# Altium project ELOC_Transmitter.PrjPcb
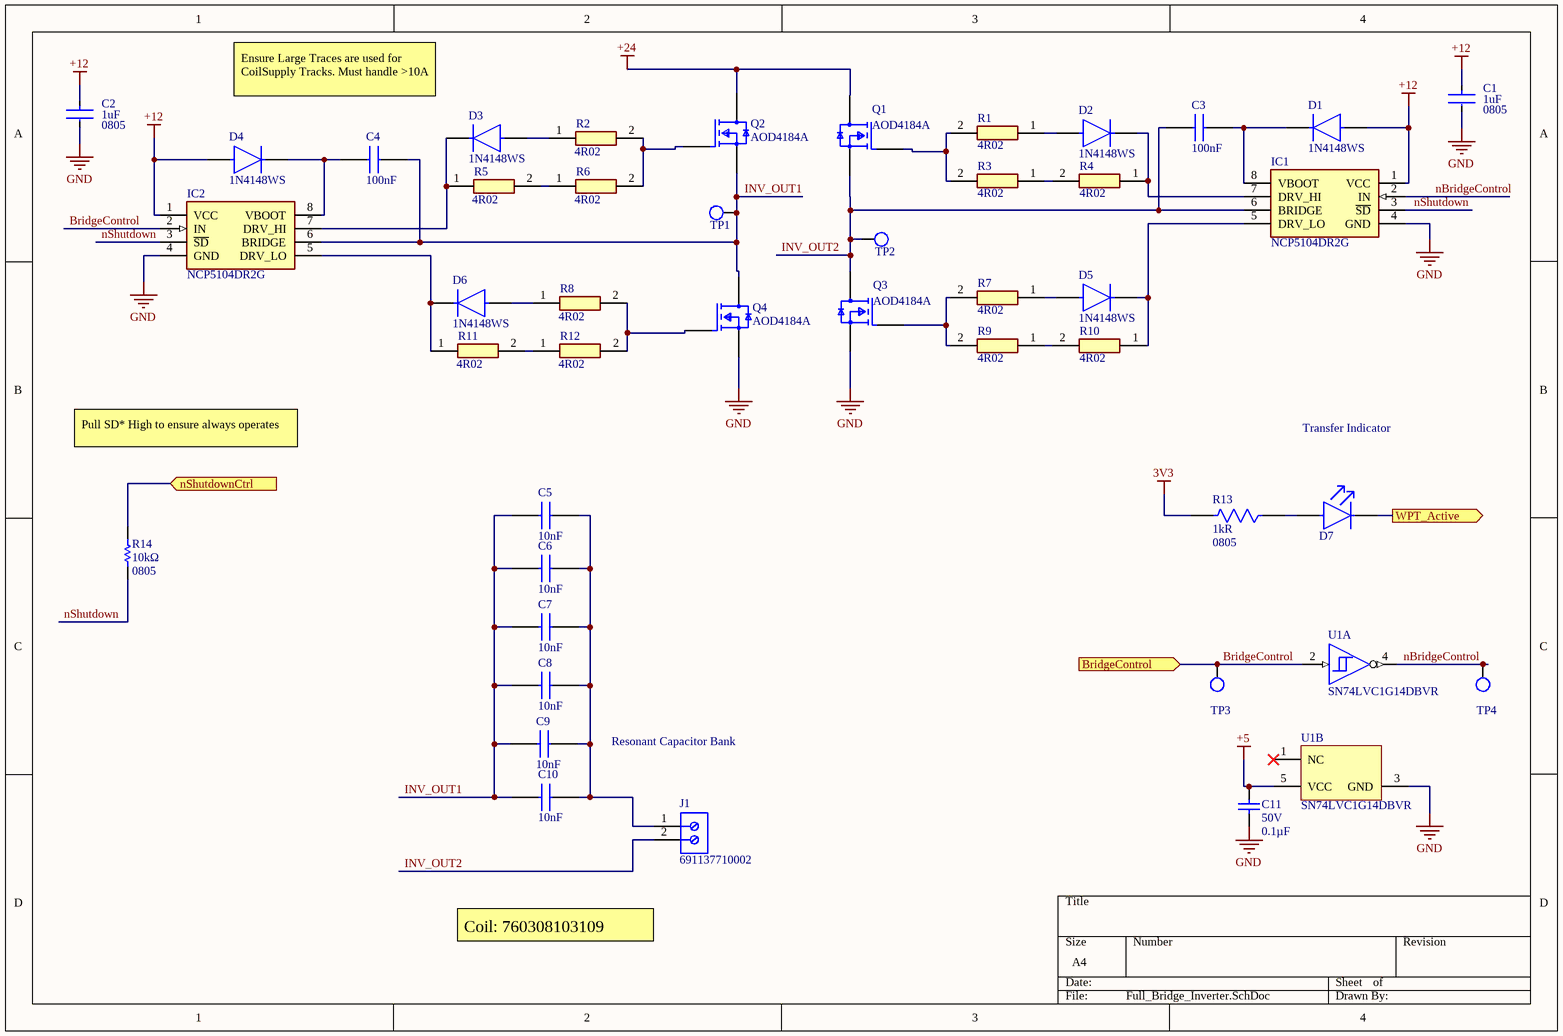
[diagram p0: Full_Bridge_Inverter.SchDoc]
3 sheets, 105 parts. Net scope: flat (ports and power ports of the same name join across sheets).
Board file: ELOC_Transmitter.PcbDoc
Sheets:
  Full_Bridge_Inverter.SchDoc
  Power.SchDoc
  Processor.SchDoc

## Sheet Full_Bridge_Inverter.SchDoc
size A4; SheetNumber: 1; SheetTotal: 3

### Parts
C1  Capacitance: 1uF  Case Code (Imperial): 0805  [FP-885012207078-MFG]  (hidden comment: 885012207078)
C2  Capacitance: 1uF  Case Code (Imperial): 0805  [FP-885012207078-MFG]  (hidden comment: 885012207078)
C3  Capacitance: 100nF  [C0805]  (hidden comment: C0805C104K1RACAUTO7210)
C4  Capacitance: 100nF  [C0805]  (hidden comment: C0805C104K1RACAUTO7210)
C5  Capacitance: 10nF  [CAPC3216X110N]  (hidden comment: C1206C103JAGECAUTO)
C6  Capacitance: 10nF  [CAPC3216X110N]  (hidden comment: C1206C103JAGECAUTO)
C7  Capacitance: 10nF  [CAPC3216X110N]  (hidden comment: C1206C103JAGECAUTO)
C8  Capacitance: 10nF  [CAPC3216X110N]  (hidden comment: C1206C103JAGECAUTO)
C9  Capacitance: 10nF  [CAPC3216X110N]  (hidden comment: C1206C103JAGECAUTO)
C10  Capacitance: 10nF  [CAPC3216X110N]  (hidden comment: C1206C103JAGECAUTO)
C11  Voltage - Rated: 50V  Capacitance: 0.1µF  [CAP0805]  (hidden comment: C0805C104K5RACTU)
D1  1N4148WS  [FP-477AB-IPC_C]
D2  1N4148WS  [FP-477AB-IPC_C]
D3  1N4148WS  [FP-477AB-IPC_C]
D4  1N4148WS  [FP-477AB-IPC_C]
D5  1N4148WS  [FP-477AB-IPC_C]
D6  1N4148WS  [FP-477AB-IPC_C]
D7  150060VS75000  [FP-150060VS75000-MFG]  (value not drawn)
IC1  NCP5104DR2G  [SOIC127P600X175-8N]
IC2  NCP5104DR2G  [SOIC127P600X175-8N]
J1  691137710002  [691137710002]
Q1  AOD4184A  [FP-TO252-MFG]
Q2  AOD4184A  [FP-TO252-MFG]
Q3  AOD4184A  [FP-TO252-MFG]
Q4  AOD4184A  [FP-TO252-MFG]
R1  Resistance: 4R02  [RESC3216X70N]  (hidden comment: RMCF1206FT4R02)
R2  Resistance: 4R02  [RESC3216X70N]  (hidden comment: RMCF1206FT4R02)
R3  Resistance: 4R02  [RESC3216X70N]  (hidden comment: RMCF1206FT4R02)
R4  Resistance: 4R02  [RESC3216X70N]  (hidden comment: RMCF1206FT4R02)
R5  Resistance: 4R02  [RESC3216X70N]  (hidden comment: RMCF1206FT4R02)
R6  Resistance: 4R02  [RESC3216X70N]  (hidden comment: RMCF1206FT4R02)
R7  Resistance: 4R02  [RESC3216X70N]  (hidden comment: RMCF1206FT4R02)
R8  Resistance: 4R02  [RESC3216X70N]  (hidden comment: RMCF1206FT4R02)
R9  Resistance: 4R02  [RESC3216X70N]  (hidden comment: RMCF1206FT4R02)
R10  Resistance: 4R02  [RESC3216X70N]  (hidden comment: RMCF1206FT4R02)
R11  Resistance: 4R02  [RESC3216X70N]  (hidden comment: RMCF1206FT4R02)
R12  Resistance: 4R02  [RESC3216X70N]  (hidden comment: RMCF1206FT4R02)
R13  Resistance: 1kR  Size Code: 0805  [FP-RNCP0805-MFG]  (hidden comment: RNCP0805FTD1K00)
R14  Resistance: 10kΩ  Package / Case: 0805  [RES0805]  (hidden comment: RC0805FR-0710KL)
TP1  Bridge 1  [TESTPOINT_LOOP]  (value not drawn)
TP2  Bridge 2  [TESTPOINT_LOOP]  (value not drawn)
TP3  Oscillator Out  [TESTPOINT_LOOP]  (value not drawn)
TP4  NOT Oscillator Out  [TESTPOINT_LOOP]  (value not drawn)
U1  SN74LVC1G14DBVR  [DBV0005A_L]  (parts A,B of 2)

### Ports
BridgeControl (in), nShutdownCtrl (in), WPT_Active (out)

### Nets
3V3: R13.2
+5: C11.2 U1.5(VCC)
+12: C1.1 C2.1 D1.2(A) D4.2(A) IC1.1(VCC) IC2.1(VCC)
+24: Q1.4(D) Q2.4(D)
GND: C1.2 C2.2 C11.1 IC1.4(GND) IC2.4(GND) Q3.3(S) Q4.3(S) U1.3(GND)
BridgeControl: IC2.2(IN) TP3.1 U1.2(A) ; port BridgeControl
INV_OUT1: C4.2 C5.1 C6.1 C7.1 C8.2 C9.2 C10.2 IC2.6(BRIDGE) Q2.3(S) Q4.4(D) TP1.1
INV_OUT2: C3.1 IC1.6(BRIDGE) J1.2 Q1.3(S) Q3.4(D) TP2.1
nBridgeControl: IC1.2(IN) TP4.1 U1.4(Y)
nShutdown: IC1.3(~{SD}) IC2.3(~{SD}) R14.1
NetC3_2: C3.2 D1.1(C) IC1.8(VBOOT)
NetC4_1: C4.1 D4.1(C) IC2.8(VBOOT)
NetC5_2: C5.2 C6.2 C7.2 C8.1 C9.1 C10.1 J1.1
NetD2_1: D2.1(C) IC1.7(DRV_HI) R4.1
NetD2_2: D2.2(A) R1.1
NetD3_1: D3.1(C) IC2.7(DRV_HI) R5.1
NetD3_2: D3.2(A) R2.1
NetD5_1: D5.1(C) IC1.5(DRV_LO) R10.1
NetD5_2: D5.2(A) R7.1
NetD6_1: D6.1(C) IC2.5(DRV_LO) R11.1
NetD6_2: D6.2(A) R8.1
NetD7_1: D7.1(C) ; port WPT_Active
NetD7_2: D7.2(A) R13.1
NetQ1_1: Q1.1(G) R1.2 R3.2
NetQ2_1: Q2.1(G) R2.2 R6.2
NetQ3_1: Q3.1(G) R7.2 R9.2
NetQ4_1: Q4.1(G) R8.2 R12.2
NetR3_1: R3.1 R4.2
NetR5_2: R5.2 R6.1
NetR9_1: R9.1 R10.2
NetR11_2: R11.2 R12.1
NetR14_2: R14.2 ; port nShutdownCtrl

Not connected (* = marked no-connect by the designer): U1 1(NC)*

### Notes on the sheet
- Ensure Large Traces are used for CoilSupply Tracks. Must handle >10A
- Pull SD* High to ensure always operates
- Transfer Indicator
- Resonant Capacitor Bank
- Coil: 760308103109

### Library data of the parts
C1 C2 = CMP-207839-000010-1: CAP CER 1UF 25V X7R 0805; Tolerance: 10%; Series: WCAP-CSGP; Mount: Surface Mount; RoHS Compliant: Yes; Case Code (Metric): 2012; Width: 0.049inch; Thickness: 0.053inch; Dielectric: X7R; Max Operating Temperature: 125°C; Case/Package: 0805; Length: 0.079inch; Voltage Rating: 25V; Packaging: Cut Tape; Min Operating Temperature: -55°C; Voltage Rating (DC): 25V
C3 C4 = C0805C104K1RACAUTO7210: Capacitor; Manufacturer_Name: KEMET; Datasheet Link: https://content.kemet.com/datasheets/KEM_C1023_X7R_AUTO_SMD.pdf; Height: 1.1mm; Manufacturer_Part_Number: C0805C104K1RACAUTO7210; Mouser Part Number: 80-C0805C104K1RAUTLR; Mouser Price/Stock: https://www.mouser.co.uk/ProductDetail/KEMET/C0805C104K1RACAUTO7210?qs=NJR6qtu0rR34GE7CYHVK6Q%3D%3D; Arrow Part Number: C0805C104K1RACAUTO7210; Arrow Price/Stock: https://www.arrow.com/en/products/c0805c104k1racauto7210/kemet-corporation?region=europe
C5-C10 = C1206C103JAGECAUTO: Capacitor; Manufacturer_Name: KEMET; Datasheet Link: https://content.kemet.com/datasheets/KEM_C1091_C0G_ESD.pdf; Height: 1.1mm; Manufacturer_Part_Number: C1206C103JAGECAUTO; Mouser Part Number: 80-C1206C103JAGECAUT; Mouser Price/Stock: https://www.mouser.co.uk/ProductDetail/KEMET/C1206C103JAGECAUTO?qs=MLItCLRbWsxJM3Q8yxQv7A%3D%3D; Arrow Part Number: C1206C103JAGECAUTO; Arrow Price/Stock: https://www.arrow.com/en/products/c1206c103jagecauto/kemet-corporation?region=nac
C11 = C0805C104K5RACTU: CAP CER 0.1UF 50V X7R 0805; Tolerance: ±10%; Supplier 1: Digi-Key; Supplier Part Number 1: 399-1170-1-ND; Temperature Coefficient: X7R; Package / Case: 0805
D1-D6 = CMP-07163-000040-1: DIODE GEN PURP 75V 150MA SOD323F; Forward Voltage: 1V; Power Dissipation: 200mW; Element Configuration: Single; Max Forward Surge Current (Ifsm): 2A; Peak Reverse Current: 5uA; Recovery Time: 4ns; Package Quantity: 1; Number of Pins: 2; Height: 1mm; REACH SVHC: No SVHC; Max Reverse Voltage (DC): 75V; Forward Current: 150mA; Length: 1.8mm; Max Repetitive Reverse Voltage (Vrrm): 75V; Max Operating Temperature: 150°C; Average Rectified Current: 150mA; Contact Plating: Tin; Packaging: Tape and Reel; Radiation Hardening: No; Min Operating Temperature: -55°C; Width: 1.35mm; Weight: 0.0276g; Lead Free: Lead Free; Mount: Surface Mount; Reverse Voltage: 75V; Reverse Recovery Time: 4ns
D7 = CMP-1426-00006-5: LED GREEN CLEAR 0603 SMD; Viewing Angle: 140°; Reverse Voltage (DC): 5V; Forward Voltage: 2V; Power Rating: 72mW; Lens Size: 0.7mm; Test Current: 20mA; Lens Color: Colorless; Lens Style: Rectangular; Luminous Intensity: 40mcd; Wavelength: 570nm; Length: 1.6mm; Max Operating Temperature: 85°C; Lens Transparency: Clear; Width: 0.8mm; Mount: Surface Mount; Weight: 0.000882oz; Package Quantity: 4000; Packaging: Cut Tape; RoHS Compliant: Yes; Case/Package: 0603; Series: WL-SMCW; Case Code (Metric): 1608; Illumination Color: Green; Color: Green; Case Code (Imperial): 0603; Forward Current: 20mA; Min Operating Temperature: -40°C; Height: 0.8mm; Dominant Wavelength: 570nm; Number of Pins: 2
IC1 IC2 = NCP5104DR2G: Integrated Circuit; Manufacturer_Name: onsemi; Datasheet Link: http://www.onsemi.com/pub/Collateral/NCP5104-D.PDF; Height: 1.75mm; Manufacturer_Part_Number: NCP5104DR2G; Mouser Part Number: 863-NCP5104DR2G; Mouser Price/Stock: https://www.mouser.co.uk/ProductDetail/onsemi/NCP5104DR2G?qs=t2BMfLoP1KTbDonJSvc7wQ%3D%3D; Arrow Part Number: NCP5104DR2G; Arrow Price/Stock: https://www.arrow.com/en/products/ncp5104dr2g/on-semiconductor
J1 = CMP-1502-03324-1: Series 1377 - 5.00 mm Horizontal Entry with Pressure Clamp WR-TBL, 2 pin; Manufacturer: Wurth Elektronik; Pin Number: 2; Pitch: 5.00mm; Operating Temperature: -30to120degC; Package Reference: 691137710002; Publisher: WurthElektronik; Mounting Technology: THT; Manufacturer URL: http://www.we-online.de; Packaging: Box; Part Number: 691137710002; Datasheet URL: http://katalog.we-online.de/pbs/datasheet/691137710002.pdf
Q1-Q4 = CMP-83955-000007-1: MOSFET N-CH 40V 50A TO252; Power Dissipation: 50W; Rds On Max: 7mR; Input Capacitance: 1.8nF; Gate to Source Voltage (Vgs): 20V; Number of Elements: 1; Max Power Dissipation: 2.3W; Min Operating Temperature: -55°C; Drain to Source Voltage (Vdss): 40V; Max Operating Temperature: 175°C; Case/Package: DPAK; Mount: Surface Mount; Continuous Drain Current (ID): 50A; Packaging: Cut Tape; Number of Pins: 3; Radiation Hardening: No
R1-R12 = RMCF1206FT4R02: Resistor; Manufacturer_Name: Stackpole Electronics; Datasheet Link: https://cs.seielect.com/catalog/SEI-RMCF_RMCP.pdf; Height: 0.7mm; Manufacturer_Part_Number: RMCF1206FT4R02; Arrow Part Number: RMCF1206FT4R02; Arrow Price/Stock: https://www.arrow.com/en/products/rmcf1206ft4r02/stackpole-electronics
R13 = CMP-26527-001902-1: 1kΩ ±1% 0.25W 0805 High Power Anti-Sulfur Thin Film Chip Resistor; Power Rating: 250mW; Temperature Coefficient: 100ppm/°C; Series: RNCP; RoHS Compliant: Yes; Case Code (Metric): 2012; Length: 0.079inch; Case/Package: 0805; Max Power Dissipation: 250mW; Height: 0.024inch; Max Operating Temperature: 155°C; Tolerance: 1%; Min Operating Temperature: -55°C; Width: 0.049inch; Case Code (Imperial): 0805; Packaging: Tape and Reel; Mount: Surface Mount; Features: Moisture Resistant; Lead Free: Lead Free; Resistor Type: Thin Film; Number of Terminations: 2
R14 = RC0805FR-0710KL: RES SMD 10K OHM 1% 1/8W 0805; Manufacturer: Yageo; Power (Watts): 0.125W, 1/8W; Temperature Coefficient: ±100ppm/°C; Supplier 1: Digi-Key; Supplier Part Number 1: 311-10.0KCRCT-ND; Tolerance: ±1%; Composition: Thick Film; Features: Moisture Resistant; Operating Temperature: -55°C ~ 155°C
TP1-TP4 = TESTPOINT_LOOP: PC TEST POINT MINIATURE WHITE; Manufacturer 1: Keystone Electronics; Manufacturer Part Number 1: 5002; Supplier Part Number 1: 36-5002-ND; Supplier 1: Digi-Key; Mount: Through Hole
U1 = CMP-0859-00030-4: Single Schmitt-Trigger Inverter, DBV0005A, LARGE T&R; Manufacturer: Texas Instruments; Input Type: CMOS/TTL; Output Drive (IOL/IOH)(Max)(mA): 32/-32; VCC(Min)(V): 1.65; 3-State Output: No; Schmitt Trigger: Yes; tpd @ Nom Voltage(Max)(ns): 11,6.5,5.5,5; VCC(Max)(V): 5.5; Output Type: CMOS; Bits(#): 1; Voltage(Nom)(V): 1.8,2.5,3.3,5; Sub-Family: Inverting Buffer/Driver; Logic: Inverting; Technology Family: LVC; F @ Nom Voltage(Max)(Mhz): 150; Rating: Catalog; ICC @ Nom Voltage(Max)(mA): 0.01; DatasheetVersion: SCES218W; PackageReference: DBV0005A; Generic Part Number: SN74LVC1G14; Operating Temperature Range(C): -40 to 125,-40 to 85

## Sheet Power.SchDoc
size A4; SheetNumber: 2; SheetTotal: 3
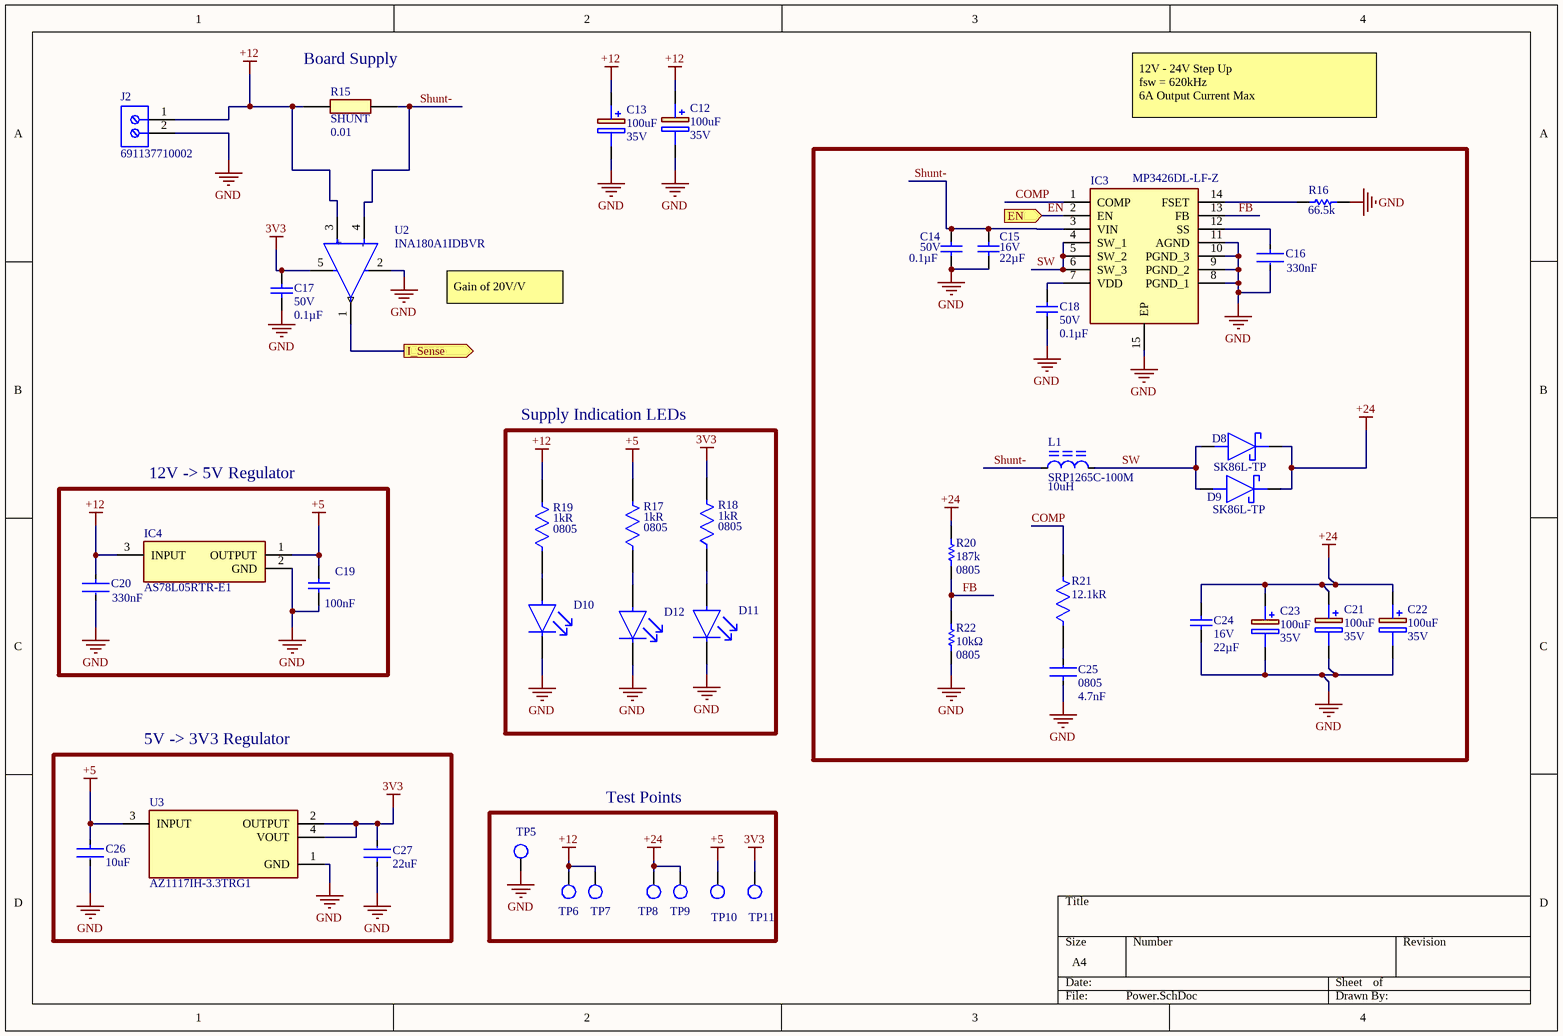
[diagram p1: Power.SchDoc]

### Parts
C12  Capacitance: 100uF  Voltage Rating: 35V  [CAPPRD250W52D630H1250]  (hidden comment: 860010573007)
C13  Capacitance: 100uF  Voltage Rating: 35V  [CAPPRD250W52D630H1250]  (hidden comment: 860010573007)
C14  Voltage - Rated: 50V  Capacitance: 0.1µF  [CAP0805]  (hidden comment: C0805C104K5RACTU)
C15  Voltage - Rated: 16V  Capacitance: 22µF  [CAP0805]  (hidden comment: CL21A226MOCLRNC)
C16  Capacitance: 330nF  [FP-CL21-F-IPC_C]  (hidden comment: CL21B334KBFNNNE)
C17  Voltage - Rated: 50V  Capacitance: 0.1µF  [CAP0805]  (hidden comment: C0805C104K5RACTU)
C18  Voltage - Rated: 50V  Capacitance: 0.1µF  [CAP0805]  (hidden comment: C0805C104K5RACTU)
C19  Capacitance: 100nF  [CAPC2013X140X50ML20T25]  (hidden comment: 08055D104KAT2A)
C20  Capacitance: 330nF  [FP-CL21-F-IPC_C]  (hidden comment: CL21B334KBFNNNE)
C21  Capacitance: 100uF  Voltage Rating: 35V  [CAPPRD250W52D630H1250]  (hidden comment: 860010573007)
C22  Capacitance: 100uF  Voltage Rating: 35V  [CAPPRD250W52D630H1250]  (hidden comment: 860010573007)
C23  Capacitance: 100uF  Voltage Rating: 35V  [CAPPRD250W52D630H1250]  (hidden comment: 860010573007)
C24  Voltage - Rated: 16V  Capacitance: 22µF  [CAP0805]  (hidden comment: CL21A226MOCLRNC)
C25  Case Code (Imperial): 0805  Capacitance: 4.7nF  [FP-CL21-IPC_A]  (hidden comment: CL21B472KBANNNC)
C26  Capacitance: 10uF  [FP-CL21-IPC_B]  (hidden comment: CL21A106KOQNNNE)
C27  Capacitance: 22uF  [FP-CL21-IPC_B]  (hidden comment: CL21A226MQQNNNG)
D8  SK86L-TP  [DIOM7959X262N]
D9  SK86L-TP  [DIOM7959X262N]
D10  150060VS75000  [FP-150060VS75000-MFG]  (value not drawn)
D11  150060VS75000  [FP-150060VS75000-MFG]  (value not drawn)
D12  150060VS75000  [FP-150060VS75000-MFG]  (value not drawn)
IC3  MP3426DL-LF-Z  [SON50P300X400X100-15N-D]
IC4  AS78L05RTR-E1  [DIODES_SOT-89]
J2  691137710002  [691137710002]
L1  SRP1265C-100M  Inductance: 10uH  [FP-SRP1265C-MFG]
R15  SHUNT  Resistance: 0.01  [RESC6434X90N]
R16  Resistance: 66.5k  [RESC2013X70X40LL20T20]  (hidden comment: ERJ-6ENF6652V)
R17  Resistance: 1kR  Size Code: 0805  [FP-RNCP0805-MFG]  (hidden comment: RNCP0805FTD1K00)
R18  Resistance: 1kR  Size Code: 0805  [FP-RNCP0805-MFG]  (hidden comment: RNCP0805FTD1K00)
R19  Resistance: 1kR  Size Code: 0805  [FP-RNCP0805-MFG]  (hidden comment: RNCP0805FTD1K00)
R20  Resistance: 187k  Package: 0805  [RESC2013X70X40NL20T20]  (hidden comment: ERJ-6ENF1873V)
R21  Resistance: 12.1kR  [FP-RNCP0805-IPC_B]  (hidden comment: RNCP0805FTD12K1)
R22  Resistance: 10kΩ  Package / Case: 0805  [RES0805]  (hidden comment: RC0805FR-0710KL)
TP5  GND  [TESTPOINT_LOOP]  (value not drawn)
TP6  12V  [TESTPOINT_LOOP]  (value not drawn)
TP7  12V  [TESTPOINT_LOOP]  (value not drawn)
TP8  24V  [TESTPOINT_LOOP]  (value not drawn)
TP9  24V  [TESTPOINT_LOOP]  (value not drawn)
TP10  5V  [TESTPOINT_LOOP]  (value not drawn)
TP11  3V3  [TESTPOINT_LOOP]  (value not drawn)
U2  INA180A1IDBVR  [FP-DBV0005A-IPC_A]
U3  AZ1117IH-3.3TRG1  [FP-SOT223-IPC_B]

### Blocks framed on the sheet
Supply Indication LEDs: D10-D12 R17-R19
12V -> 5V Regulator: C19 C20 IC4
5V -> 3V3 Regulator: C26 C27 U3
Test Points: TP5-TP11

### Ports
EN (in), I_Sense (out)

### Nets
3V3: C17.2 C27.2 R18.2 TP11.1 U2.5(VS) U3.2(OUTPUT) U3.4(VOUT)
+5: C19.2 C26.1 IC4.1(OUTPUT) R17.2 TP10.1 U3.3(INPUT)
+12: C12.1(+) C13.1(+) C20.1 IC4.3(INPUT) J2.1 R15.1 R19.2 TP6.1 TP7.1 U2.3(IN+)
+24: C21.1(+) C22.1(+) C23.1(+) C24.2 D8.1(K) D9.1(K) R20.1 TP8.1 TP9.1
GND: C12.2(-) C13.2(-) C14.1 C15.1 C16.2 C17.1 C18.1 C19.1 C20.2 C21.2(-) C22.2(-) C23.2(-) C24.1 C25.1 C26.2 C27.1 D10.1(C) D11.1(C) D12.1(C) IC3.8(PGND_1) IC3.9(PGND_2) IC3.10(PGND_3) IC3.11(AGND) IC3.15(EP) IC4.2(GND) J2.2 R16.1 R22.1 TP5.1 U2.2(GND) U3.1(GND)
COMP: IC3.1(COMP) R21.2
EN: IC3.2(EN) ; port EN
FB: IC3.13(FB) R20.2 R22.2
Shunt-: C14.2 C15.2 IC3.3(VIN) L1.1 R15.2 U2.4(IN-)
SW: D8.2(A) D9.2(A) IC3.4(SW_1) IC3.5(SW_2) IC3.6(SW_3) L1.2
NetC16_1: C16.1 IC3.12(SS)
NetC18_2: C18.2 IC3.7(VDD)
NetC25_2: C25.2 R21.1
NetD10_2: D10.2(A) R19.1
NetD11_2: D11.2(A) R18.1
NetD12_2: D12.2(A) R17.1
NetIC3_14: IC3.14(FSET) R16.2
NetU2_1: U2.1(OUT) ; port I_Sense

### Notes on the sheet
- (near R15) Board Supply
- 12V - 24V Step Up
  fsw = 620kHz
  6A Output Current Max
- Gain of 20V/V
- (in symbol CMP-04895-000140-1) +; -

### Library data of the parts
C12 C13 C21-C23 = 860010573007: Capacitor Polarised; Manufacturer_Name: Wurth Elektronik; Datasheet Link: http://katalog.we-online.de/pbs/datasheet/860010573007.pdf; Height: 12.5mm; Manufacturer_Part_Number: 860010573007; Mouser Part Number: 710-860010573007; Mouser Price/Stock: https://www.mouser.co.uk/ProductDetail/Wurth-Elektronik/860010573007?qs=0KOYDY2FL2%2FkmR1S6v%2F3Lg%3D%3D
C14 C17 C18 = C0805C104K5RACTU: as C11 on sheet Full_Bridge_Inverter; Supplier 1: Digi-Key; Supplier Part Number 1: 399-1170-1-ND; Temperature Coefficient: X7R; Package / Case: 0805
C15 C24 = CL21A226MOCLRNC: CAP CER 22UF 16V X5R 0805; Tolerance: ±20%; Supplier 1: Digi-Key; Supplier Part Number 1: 1276-6780-1-ND; Temperature Coefficient: X5R; Footprint: 0805
C16 C20 = CMP-13271-000003-1: CAP CER 0.33UF 50V X7R 0805; Manufacturer: Samsung Electro-Mechanics; Temperature Coefficient: 15%; Value: 330nF; Material: Ceramic; Tolerance: 10%; Category: Cap; Temperature Range Low: -55°C; Height: 1.35mm; Ipc Land Pattern Name: CAPC200125X125; ComponentLink2URL: http://www.samsungsem.com/kr/support/product-search/mlcc/__icsFiles/afieldfile/2018/07/24/CL21B334KBFNNNE.pdf; Octopart: https://octopart.com/cl21b334kbfnnne-samsung-9287149; Digikey Description: CAP CER 0.33UF 50V X7R 0805; Automotive: No; ComponentLink2Description: Datasheet; Lead Free: Yes; Voltage Rating: 50V; Device Class L2: Capacitors; Device Class L1: Passive Components; RoHS: TRUE; Manufacturer Part Number: CL21B334KBFNNNE; Temperature: -55°C to +125°C; Package: CL21-F; Temperature Range High: +125°C; Temperature Characteristic: X7R; Device Class L3: Ceramic Capacitors
C19 = CMP-2007-04689-1: Manufacturer: AVX Interconnect / Elco; Part Number: 08055D104KAT2A
C25 = CMP-13271-001405-1: CL21 Series 0805 4.7nF 50V ±10% Tolerance X7R Multilayer Ceramic Chip Capacitor; Min Operating Temperature: -55°C; Width: 0.049inch; Contact Plating: Tin; Mount: Surface Mount; Voltage Rating (DC): 50V; Tolerance: 10%; Packaging: Tape and Reel; Case Code (Metric): 2012; Package Quantity: 1; Height: 0.65mm; Radiation Hardening: No; Length: 2mm; Lead Free: Lead Free; Voltage: 50V; Thickness: 0.03inch; Max Operating Temperature: 125°C; Dielectric: X7R; Voltage Rating: 50V; Depth: 1.25mm; Material: Ceramic; Case/Package: 0805
C26 = CMP-2000-06102-2: CL21 Series 0805 10uF 16V ±10% Tolerance X5R Multilayer Ceramic Chip Capacitor; Dielectric: X7R; Length: 2mm; Depth: 1.25mm; Voltage: 16V; Width: 0.049inch; Lead Free: Lead Free; Max Operating Temperature: 85°C; Mount: Surface Mount; Voltage Rating: 16V; Height: 1.25mm; Radiation Hardening: No; Packaging: Tape and Reel; Voltage Rating (DC): 16V; Thickness: 0.055inch; Case/Package: 0805; Case Code (Imperial): 0805; Min Operating Temperature: -55°C; Case Code (Metric): 2012; Package Quantity: 1; Tolerance: 10%
C27 = CMP-13271-002967-1: CL21 Series 0805 22uF 6.3V ±20% Tolerance X5R Multilayer Ceramic Chip Capacitor; Tolerance: 20%; Case Code (Imperial): 0805; Package Quantity: 3000; Min Operating Temperature: -55°C; Case Code (Metric): 2012; Length: 2mm; Material: Ceramic; Max Operating Temperature: 85°C; Radiation Hardening: No; Packaging: Tape and Reel; Depth: 1.25mm; Mount: Surface Mount; Dielectric: X5R; Case/Package: 0805; Height: 1.25mm; Thickness: 0.055inch; Voltage: 6.3V; Width: 0.049inch; Voltage Rating: 6.3V
D8 D9 = SK86L-TP: Schottky Diode; Manufacturer_Name: Micro Commercial Components (MCC); Datasheet Link: https://www.mccsemi.com/pdf/Products/SK82L-SK810L(SMC).PDF; Height: 2.62mm; Manufacturer_Part_Number: SK86L-TP; Mouser Part Number: 833-SK86L-TP; Mouser Price/Stock: https://www.mouser.co.uk/ProductDetail/Micro-Commercial-Components-MCC/SK86L-TP?qs=Fllw7YelV3%2FmZPZoVB2kyw%3D%3D; Arrow Part Number: SK86L-TP; Arrow Price/Stock: https://www.arrow.com/en/products/sk86l-tp/micro-commercial-components?region=nac
D10-D12 = CMP-1426-00006-5: as D7 on sheet Full_Bridge_Inverter; Length: 1.6mm; Max Operating Temperature: 85°C; Lens Transparency: Clear; Width: 0.8mm; Mount: Surface Mount; Weight: 0.000882oz; Package Quantity: 4000; Packaging: Cut Tape; RoHS Compliant: Yes; Case/Package: 0603; Series: WL-SMCW; Case Code (Metric): 1608; Illumination Color: Green; Color: Green; Case Code (Imperial): 0603; Forward Current: 20mA; Min Operating Temperature: -40°C; Height: 0.8mm; Dominant Wavelength: 570nm; Number of Pins: 2
IC3 = MP3426DL-LF-Z: Integrated Circuit; Manufacturer_Name: Monolithic Power Systems (MPS); Datasheet Link: https://www.monolithicpower.com/en/documentview/productdocument/index/version/2/document_type/Datasheet/lang/en/sku/MP3426/; Height: 1mm; Manufacturer_Part_Number: MP3426DL-LF-Z; Mouser Part Number: 946-MP3426DL-LF-Z; Mouser Price/Stock: https://www.mouser.co.uk/ProductDetail/Monolithic-Power-Systems-MPS/MP3426DL-LF-Z?qs=Z3CaLxJiOJL0MxCuEKYvhQ%3D%3D
IC4 = AS78L05RTR-E1: Integrated Circuit; Manufacturer_Name: Diodes Inc.; Datasheet Link: https://www.diodes.com/assets/Datasheets/AS78Lxx.pdf; Manufacturer_Part_Number: AS78L05RTR-E1; Mouser Part Number: 621-AS78L05RTR-E1; Mouser Price/Stock: https://www.mouser.co.uk/ProductDetail/Diodes-Incorporated/AS78L05RTR-E1?qs=FKu9oBikfSksfBIasZ7FtQ%3D%3D; Arrow Part Number: AS78L05RTR-E1; Arrow Price/Stock: https://www.arrow.com/en/products/as78l05rtr-e1/diodes-incorporated?region=asia
J2 = CMP-1502-03324-1: as J1 on sheet Full_Bridge_Inverter; Operating Temperature: -30to120degC; Package Reference: 691137710002; Publisher: WurthElektronik; Mounting Technology: THT; Manufacturer URL: http://www.we-online.de; Packaging: Box; Part Number: 691137710002; Datasheet URL: http://katalog.we-online.de/pbs/datasheet/691137710002.pdf
L1 = CMP-07248-000045-1: FIXED IND 10UH 12A 18 MOHM SMD; Part Number: SRP1265C-100M
R15 = CRA2512-FZ-R010ELF: Resistor; Manufacturer_Name: Bourns; Datasheet Link: http://www.bourns.com/PDFs/CRA.pdf; Height: 0.9mm; Manufacturer_Part_Number: CRA2512-FZ-R010ELF; Mouser Part Number: 652-CRA2512FZR010ELF; Mouser Price/Stock: https://www.mouser.co.uk/ProductDetail/Bourns/CRA2512-FZ-R010ELF?qs=WqWCsLCZBkoNPiv%2FXVnYvw%3D%3D; Arrow Part Number: CRA2512-FZ-R010ELF; Arrow Price/Stock: https://www.arrow.com/en/products/cra2512-fz-r010elf/bourns
R16 = CMP-2001-00269-1: Manufacturer: Panasonic; Part Number: ERJ-6ENF6652V
R17-R19 = CMP-26527-001902-1: as R13 on sheet Full_Bridge_Inverter; Series: RNCP; RoHS Compliant: Yes; Case Code (Metric): 2012; Length: 0.079inch; Case/Package: 0805; Max Power Dissipation: 250mW; Height: 0.024inch; Max Operating Temperature: 155°C; Tolerance: 1%; Min Operating Temperature: -55°C; Width: 0.049inch; Case Code (Imperial): 0805; Packaging: Tape and Reel; Mount: Surface Mount; Features: Moisture Resistant; Lead Free: Lead Free; Resistor Type: Thin Film; Number of Terminations: 2
R20 = CMP-1013-00765-2: Manufacturer: Panasonic; Part Number: ERJ-6ENF1873V
R21 = CMP-26527-004331-1: 12.1kΩ ±1% 0.25W 0805 High Power Anti-Sulfur Thin Film Chip Resistor; Temperature Coefficient: 100ppm/°C; Max Power Dissipation: 250mW; Width: 0.049inch; Mount: Surface Mount; RoHS Compliant: Yes; Min Operating Temperature: -55°C; Case/Package: 0805; Case Code (Metric): 2012; Length: 0.079inch; Number of Terminations: 2; Resistor Type: Thin Film; Series: RNCP; Packaging: Tape and Reel; Case Code (Imperial): 0805; Max Operating Temperature: 155°C; Height: 0.024inch; Features: Moisture Resistant; Tolerance: 1%
R22 = RC0805FR-0710KL: as R14 on sheet Full_Bridge_Inverter; Supplier 1: Digi-Key; Supplier Part Number 1: 311-10.0KCRCT-ND; Tolerance: ±1%; Composition: Thick Film; Features: Moisture Resistant; Operating Temperature: -55°C ~ 155°C
TP5-TP11 = TESTPOINT_LOOP: as TP1 on sheet Full_Bridge_Inverter; Supplier Part Number 1: 36-5002-ND; Supplier 1: Digi-Key; Mount: Through Hole
U2 = CMP-04895-000140-1: IC CURR SENSE 1 CIRCUIT SOT23-5; Input Bias Current: 100nA; Input Offset Voltage (Vos): 100uV; Number of Circuits: 1; Slew Rate: 2V/µs; -3db Bandwidth: 350kHz; Operating Supply Current: 260uA; Case/Package: SOT-23-5; Min Operating Temperature: -40°C; Mount: Surface Mount; Packaging: Tape and Reel; Max Operating Temperature: 125°C
U3 = CMP-12756-000043-1: IC REG LINEAR 3.3V 1A SOT223; Output Current: 800mA; Number of Regulators: 1; Dropout Voltage: 1.2V; RoHS Compliant: Yes; Min Current Limit: 1A; Mount: Surface Mount; Packaging: Tape and Reel; Output Voltage: 3.3V; Min Operating Temperature: -40°C; Max Operating Temperature: 125°C; Number of Pins: 3; Case/Package: TO-261-4

## Sheet Processor.SchDoc
size A4; SheetNumber: 3; SheetTotal: 3
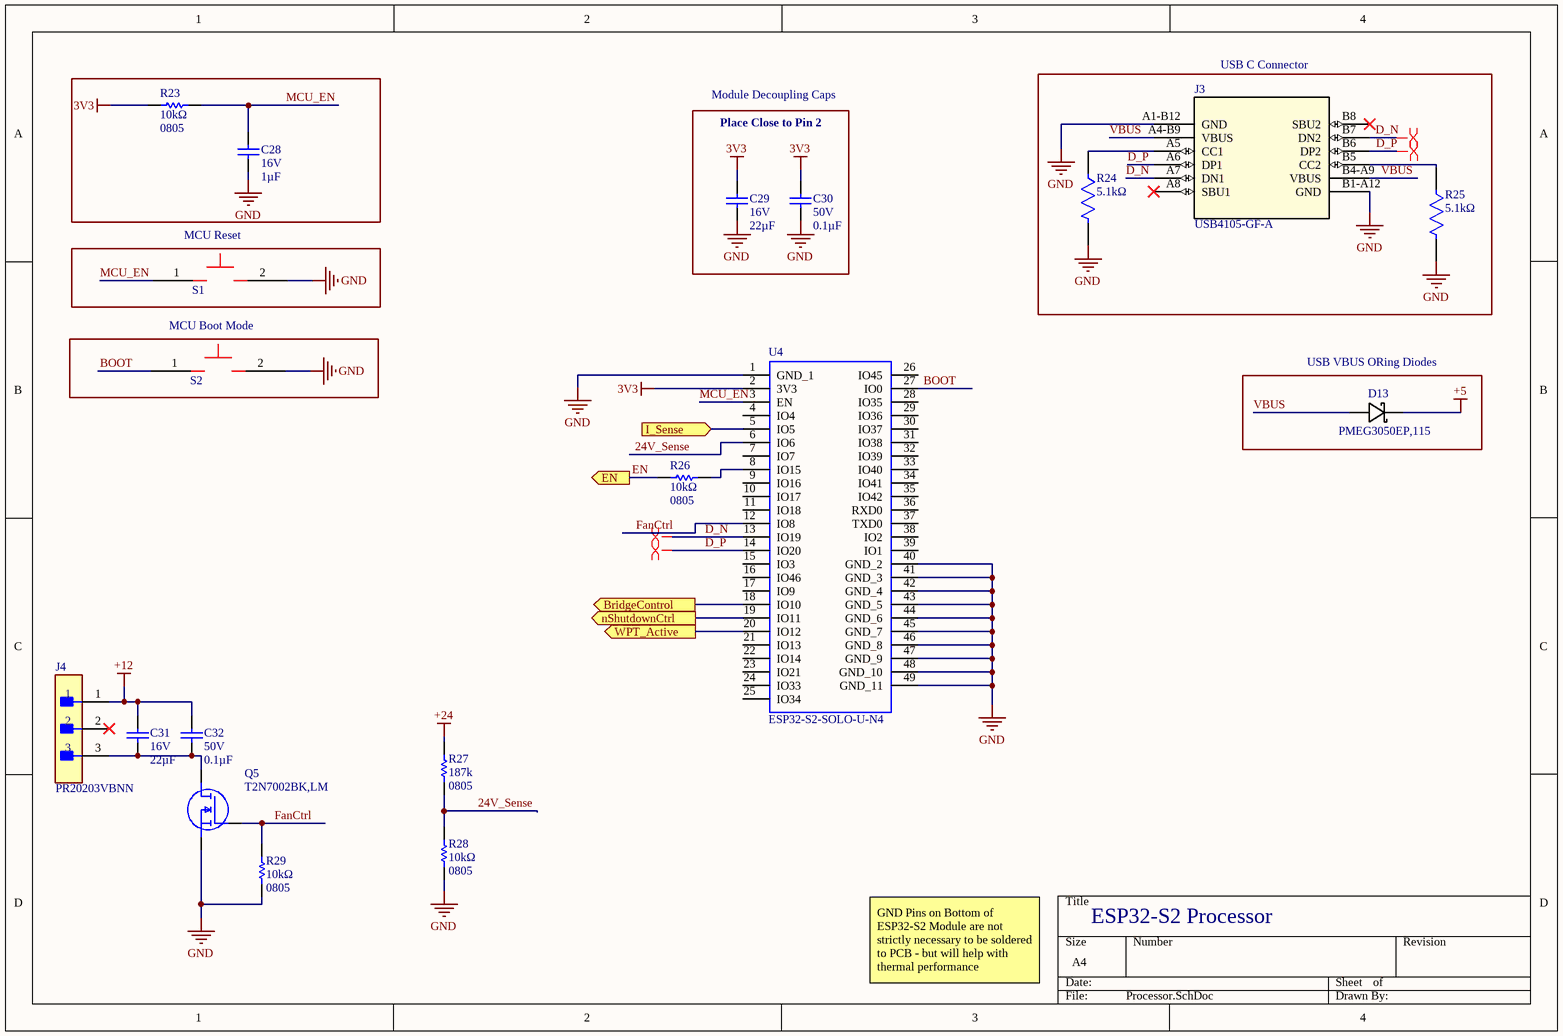
[diagram p2: Processor.SchDoc]

### Parts
C28  Voltage - Rated: 16V  Capacitance: 1µF  [CAP0805]  (hidden comment: GRM21BR71C105KA01L)
C29  Voltage - Rated: 16V  Capacitance: 22µF  [CAP0805]  (hidden comment: CL21A226MOCLRNC)
C30  Voltage - Rated: 50V  Capacitance: 0.1µF  [CAP0805]  (hidden comment: C0805C104K5RACTU)
C31  Voltage - Rated: 16V  Capacitance: 22µF  [CAP0805]  (hidden comment: CL21A226MOCLRNC)
C32  Voltage - Rated: 50V  Capacitance: 0.1µF  [CAP0805]  (hidden comment: C0805C104K5RACTU)
D13  MFG_PN: PMEG3050EP,115  [SOD-128]  (hidden comment: D_PMEG3050EP,115)
J3  USB4105-GF-A  [USB4105_GCT]
J4  PR20203VBNN  [FP-PR20203VBNN-MFG]
Q5  T2N7002BK,LM  [TBAT54CLM]
R23  Resistance: 10kΩ  Package / Case: 0805  [RES0805]  (hidden comment: RC0805FR-0710KL)
R24  Resistance: 5.1kΩ  [FP-CRCW0805-e3-MFG]  (hidden comment: CRCW08055K10FKEA)
R25  Resistance: 5.1kΩ  [FP-CRCW0805-e3-MFG]  (hidden comment: CRCW08055K10FKEA)
R26  Resistance: 10kΩ  Package / Case: 0805  [RES0805]  (hidden comment: RC0805FR-0710KL)
R27  Resistance: 187k  Package: 0805  [RESC2013X70X40NL20T20]  (hidden comment: ERJ-6ENF1873V)
R28  Resistance: 10kΩ  Package / Case: 0805  [RES0805]  (hidden comment: RC0805FR-0710KL)
R29  Resistance: 10kΩ  Package / Case: 0805  [RES0805]  (hidden comment: RC0805FR-0710KL)
S1  RESET  [Tactile_Button_3X6X2]  (value not drawn)
S2  BOOT  [Tactile_Button_3X6X2]  (value not drawn)
U4  ESP32-S2-SOLO-U-N4  [ESP32S2SOLOUN4]

### Blocks framed on the sheet
USB C Connector: J3 R24 R25
MCU Reset: S1
MCU Boot Mode: S2
USB VBUS ORing Diodes: D13

### Ports
BridgeControl (out), EN (out), I_Sense (in), nShutdownCtrl (out), WPT_Active (out)

### Nets
3V3: C29.2 C30.2 R23.1 U4.2(3V3)
+5: D13.2
+12: C31.2 C32.2 J4.1
+24: R27.1
GND: C28.1 C29.1 C30.1 J3.A1-B12(GND) J3.B1-A12(GND) Q5.2(S) R24.2 R25.2 R28.1 R29.1 S1.2 S2.2 U4.1(GND_1) U4.40(GND_2) U4.41(GND_3) U4.42(GND_4) U4.43(GND_5) U4.44(GND_6) U4.45(GND_7) U4.46(GND_8) U4.47(GND_9) U4.48(GND_10) U4.49(GND_11)
24V_Sense: R27.2 R28.2 U4.6(IO6)
BOOT: S2.1 U4.27(IO0)
BridgeControl: U4.18(IO10) ; port BridgeControl
D_N: J3.A7(DN1) J3.B7(DN2) U4.13(IO19)
D_P: J3.A6(DP1) J3.B6(DP2) U4.14(IO20)
EN: R26.1 ; port EN
FanCtrl: Q5.1(G) R29.2 U4.12(IO8)
MCU_EN: C28.2 R23.2 S1.1 U4.3(EN)
VBUS: D13.1 J3.A4-B9(VBUS) J3.B4-A9(VBUS)
NetC31_1: C31.1 C32.1 J4.3 Q5.3(D)
NetD7_1: U4.20(IO12) ; port WPT_Active
NetJ3_A5: J3.A5(CC1) R24.1
NetJ3_B5: J3.B5(CC2) R25.1
NetR14_2: U4.19(IO11) ; port nShutdownCtrl
NetR26_2: R26.2 U4.8(IO15)
NetU2_1: U4.5(IO5) ; port I_Sense

Not connected (* = marked no-connect by the designer): J3 A8(SBU1)* B8(SBU2)*; J4 2*; U4 4(IO4) 7(IO7) 9(IO16) 10(IO17) 11(IO18) 15(IO3) 16(IO46) 17(IO9) 21(IO13) 22(IO14) 23(IO21) 24(IO33) 25(IO34) 26(IO45) 28(IO35) 29(IO36) 30(IO37) 31(IO38) 32(IO39) 33(IO40) 34(IO41) 35(IO42) 36(RXD0) 37(TXD0) 38(IO2) 39(IO1)

### Layout directives
differential pair: D_N, D_P

### Notes on the sheet
- Module Decoupling Caps
- Place Close to Pin 2
- ESP32-S2 Processor
- GND Pins on Bottom of ESP32-S2 Module are not strictly necessary to be soldered to PCB - but will help with thermal performance

### Library data of the parts
C28 = GRM21BR71C105KA01L: CAP CER 1UF 16V X7R 0805; Manufacturer: Murata Electronics North America; Tolerance: ±10%; Temperature Coefficient: X7R; Operating Temperature: -55°C ~ 125°C; Supplier 1: Digi-Key; Supplier Part Number 1: 490-1691-1-ND; Package / Case: 0805
C29 C31 = CL21A226MOCLRNC: as C15 on sheet Power; Supplier 1: Digi-Key; Supplier Part Number 1: 1276-6780-1-ND; Temperature Coefficient: X5R; Footprint: 0805
C30 C32 = C0805C104K5RACTU: as C11 on sheet Full_Bridge_Inverter; Supplier 1: Digi-Key; Supplier Part Number 1: 399-1170-1-ND; Temperature Coefficient: X7R; Package / Case: 0805
D13 = D_PMEG3050EP,115: DIODE SCHOTTKY 360mV 30V 5A; MFG: Nexperia; Supplier: Digikey; Supplier_PN: 1727-5317-1-ND
J3 = USB4105-GF-A: No Description Available; Mfr_Name: Global Connector Technology; Copyright: Copyright (C) 2022 Ultra Librarian. All rights reserved.; Manufacturer_Part_Number: USB4105-GF-A; Digi-Key_Part_Number_1: 2073-USB4105-GF-ACT-ND; Digi-Key_Part_Number_2: 2073-USB4105-GF-ADKR-ND; Digi-Key_Part_Number_3: 2073-USB4105-GF-ATR-ND; RefDes: RefDes; Type: DEV
J4 = CMP-77940-000002-1: CONN HEADER VERT 3POS 2.54MM; Manufacturer: Metz Connect; Conn Orientation: Straight; Current Rating: 3A; Number Of Contacts: 3; Conn Gender: Male; Temperature: -40°C to +105°C; Pitch: 2.54mm; Device Class L1: Connectors; Digikey Description: CONN HEADER VERT 3POS 2.54MM; ComponentLink2URL: https://datasheet.octopart.com/PR20203VBNN-Metz-Connect-datasheet-101610322.pdf; Height: 8.6mm; Temperature Range High: +105°C; Manufacturer Part Number: PR20203VBNN; Number Of Rows: 1; Octopart: https://octopart.com/pr20203vbnn-metz+connect-87667116; Device Class L3: unset; ComponentLink2Description: Datasheet; Device Class L2: Headers and Wire Housings; Temperature Range Low: -40°C; Automotive: No; Contact Material: Gold,Nickel; Category: Conn; Lead Free: Yes; RoHS: TRUE; Package: PR20203VBNN
Q5 = T2N7002BK,LM: MOSFET (N-Channel); Manufacturer_Name: Toshiba; Datasheet Link: https://toshiba.semicon-storage.com/info/docget.jsp?did=30376&prodName=T2N7002BK; Height: 1.1mm; Manufacturer_Part_Number: T2N7002BK,LM; Mouser Part Number: 757-T2N7002BKLM; Mouser Price/Stock: https://www.mouser.co.uk/ProductDetail/Toshiba/T2N7002BKLM?qs=lX6dEUlT%252BgfTnU11z%2FTylg%3D%3D; Arrow Part Number: T2N7002BK,LM; Arrow Price/Stock: https://www.arrow.com/en/products/t2n7002bklm/toshiba?region=nac
R23 R26 R28 R29 = RC0805FR-0710KL: as R14 on sheet Full_Bridge_Inverter; Supplier 1: Digi-Key; Supplier Part Number 1: 311-10.0KCRCT-ND; Tolerance: ±1%; Composition: Thick Film; Features: Moisture Resistant; Operating Temperature: -55°C ~ 155°C
R24 R25 = CMP-2001-04024-2: RES Thick Film, 5.1kΩ, 1%, 0.125W, 100ppm/°C, 0805; Power Rating: 125mW; Voltage Rating (DC): 150V; Packaging: Tape and Reel; Case Code (Metric): 2012; Contact Plating: Tin; Case Code (Imperial): 0805; Depth: 1.25mm; Tolerance: 1%; Width: 0.049inch; Temperature Coefficient: 100ppm/°C; Max Power Dissipation: 125mW; Military Standard: Not; Lead Free: Lead Free; Mount: Surface Mount; Min Operating Temperature: -55°C; Package Quantity: 10; Weight: 0.000194oz; Height: 0.45mm; Number of Terminations: 2; Max Operating Temperature: 155°C; Termination: SMD/SMT; Case/Package: 0805; Composition: Thick Film; Voltage Rating: 150V; Length: 2mm; Features: Automotive AEC-Q200; Radiation Hardening: No
R27 = CMP-1013-00765-2: Manufacturer: Panasonic; Part Number: ERJ-6ENF1873V
S1 S2 = Tactile Button_3X6X2
U4 = ESP32-S2-SOLO-U-N4: WiFi Modules - 802.11 SMD module, ESP32-S2, 4 MB SPI flash, IPEX antenna; Manufacturer_Name: Espressif Systems; Geometry.Height: 3.35mm; Mouser Part Number: 356-ESP32-S2-SOLOUN4; Mouser Price/Stock: https://www.mouser.co.uk/ProductDetail/Espressif-Systems/ESP32-S2-SOLO-U-N4?qs=pBJMDPsKWf24meOzbFo%252B2g%3D%3D; Manufacturer_Part_Number: ESP32-S2-SOLO-U-N4; Datasheet Link: https://www.espressif.com/sites/default/files/documentation/esp32-s2-solo_esp32-s2-solo-u_datasheet_en.pdf

## Nets that join several sheets
3V3: Full_Bridge_Inverter (R13.2), Power (7 pins), Processor (C29.2 C30.2 R23.1 U4.2)
+5: Full_Bridge_Inverter (C11.2 U1.5), Power (6 pins), Processor (D13.2)
+12: Full_Bridge_Inverter (6 pins), Power (10 pins), Processor (C31.2 C32.2 J4.1)
+24: Full_Bridge_Inverter (Q1.4 Q2.4), Power (9 pins), Processor (R27.1)
GND: Full_Bridge_Inverter (8 pins), Power (31 pins), Processor (23 pins)
BridgeControl: Full_Bridge_Inverter (IC2.2 TP3.1 U1.2), Processor (U4.18)
EN: Power (IC3.2), Processor (R26.1)
NetD7_1: Full_Bridge_Inverter (D7.1), Processor (U4.20)
NetR14_2: Full_Bridge_Inverter (R14.2), Processor (U4.19)
NetU2_1: Power (U2.1), Processor (U4.5)